# Altium project TrafficLight.PrjPcb
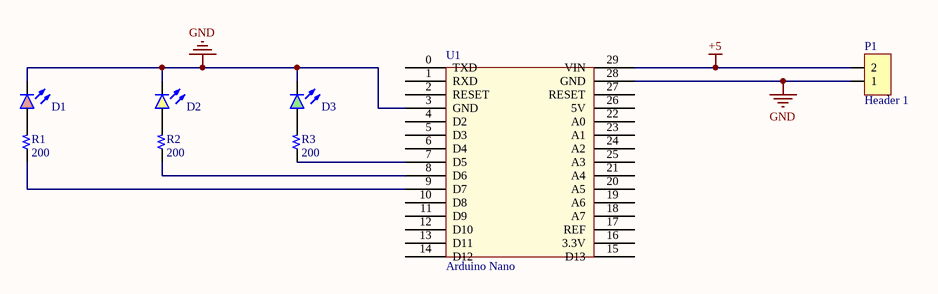
[diagram p0: SCH_TRAFFICLIGHT.SchDoc]
1 sheet, 8 parts. Net scope: global (net labels, ports and power ports of the same name join across sheets).
Board file: PCB_TRAFFICLIGHT.PcbDoc

## Sheet SCH_TRAFFICLIGHT.SchDoc
size A; SheetNumber: 1; SheetTotal: 1

### Parts
D1  LED RED  [LED 10MM - RED]  (value not drawn)
D2  LED YELLOW  [LED 10MM - YELLOW]  (value not drawn)
D3  LED GREEN  [LED 10MM - GREEN]  (value not drawn)
P1  Header 1  [HDR/Terminal/2]
R1  200  [R 1/4W/300]
R2  200  [R 1/4W/300]
R3  200  [R 1/4W/300]
U1  Arduino Nano  [Arduino nano]

### Nets
+5: P1.2 U1.29(VIN)
GND: D1.2(K) D2.2(K) D3.2(K) P1.1 U1.3(GND) U1.28(GND)
NetD1_1: D1.1(A) R1.2
NetD2_1: D2.1(A) R2.2
NetD3_1: D3.1(A) R3.2
NetR1_1: R1.1 U1.9(D7)
NetR2_1: R2.1 U1.8(D6)
NetR3_1: R3.1 U1.7(D5)

Not connected (* = marked no-connect by the designer): U1 0(TXD) 1(RXD) 2(RESET) 4(D2) 5(D3) 6(D4) 10(D8) 11(D9) 12(D10) 13(D11) 14(D12) 15(D13) 16(3.3V) 17(REF) 18(A7) 19(A6) 20(A5) 21(A4) 22(A0) 23(A1) 24(A2) 25(A3) 26(5V) 27(RESET)

### Library data of the parts
D1 = LED RED: Typical LED 3-pin 2-color
D2 = LED YELLOW: Typical LED 3-pin 2-color
D3 = LED GREEN: Typical LED 3-pin 2-color
P1 = Header 2: Header, 2-Pin
R1-R3 = Resistor
U1 = arduinoNano